# Altium schematic sheet 25-Power-CPU.SchDoc
size B; SheetNumber: 25; SheetTotal: 25; SPICEModelCachePRDMSQGY: <root> / <DocumentId>PRDMSQGY</DocumentId> / <CacheFrame Number="0"> / <Model Name="emk105bj105_v-f" Kind="CKT"> / <Text>* EMK105BJ105_V-F     SPICE MODEL  ( General Type ) / *-------------------------------------------------------------------------------------------------------- / * Model Generated by TAIYO YUDEN Corporation (http://www.ty-top.com) / * Version 1.0 / * TAIYO YUDEN Control No. 170508_130520 / * Copyright(c) 2012 TAIYO YUDEN CO.,LTD. All Rights Reserved. / *-------------------------------------------------------------------------------------------------------- / * / * Products Name : Multilayer Ceramic Capacitors / * / * Characteristics : / *     Capacitance : 1 uF , Rated Voltage : 16V , TCC : X5R / *     Case Size : 1.0 x 0.5 / 0.039 x 0.02 [mm/inch] , Thickness : 0.5 / 0.02 [mm/inch] / *     (Conditions: Temperature = 25 degC , DC Bias Current/Voltage = 0A / 0V) / * / * Frequency Range : 40Hz - 3GHz / * / * External Node Assignments : / * / *  1  o---| |---o  2 / * / *-------------------------------------------------------------------------------------------------------- / .SubCkt EMK105BJ105_V-F 1 2 / **************************** / C0 1 110 0.68309u / Cm 1 101 0.26053u / C1 101 102 0.94076u / Rc1 101 102 1.9029k / C2 102 103 0.66707u / Rc2 102 103 120.36 / C3 103 110 0.57203u / Rc3 103 110 2.1097 / C2m 1 301 0.1871u / C21 301 302 3.2494u / Rc21 301 302 1.1117k / C22 302 303 2.1014u / Rc22 302 303 1.484k / C23 303 304 2.1172u / Rc23 303 304 1.3876k / C24 304 305 0.75729u / Rc24 304 305 332.59 / C25 305 306 0.94401u / Rc25 305 306 249.09 / C26 306 307 0.34674u / Rc26 306 307 28.352 / C27 307 308 0.37158u / Rc27 307 308 19.989 / C28 308 309 0.17933u / Rc28 308 309 31.748 / C29 309 110 0.016445u / Rc29 309 110 1.0592 / Rp0 1 110 100Meg / L0 110 120 0.2216n / Lm 120 130 0.1509n / L1 120 121 0.12659n / RL1 121 130 0.85161 / L2 120 122 0.15996n / RL2 122 130 0.42469 / L3 120 123 7.9543n / RL3 123 130 0.54643m / CR 120 124 0.24334u / LR 124 125 0.090738n / RR 125 130 68.076m / CL 130 140 2.7354p / LL 130 140 0.10762n / RL 130 140 50.614 / Rs 140 2 7.5416m / **************************** / .ends EMK105BJ105_V-F</Text> / </Model> / </CacheFrame> / </root>
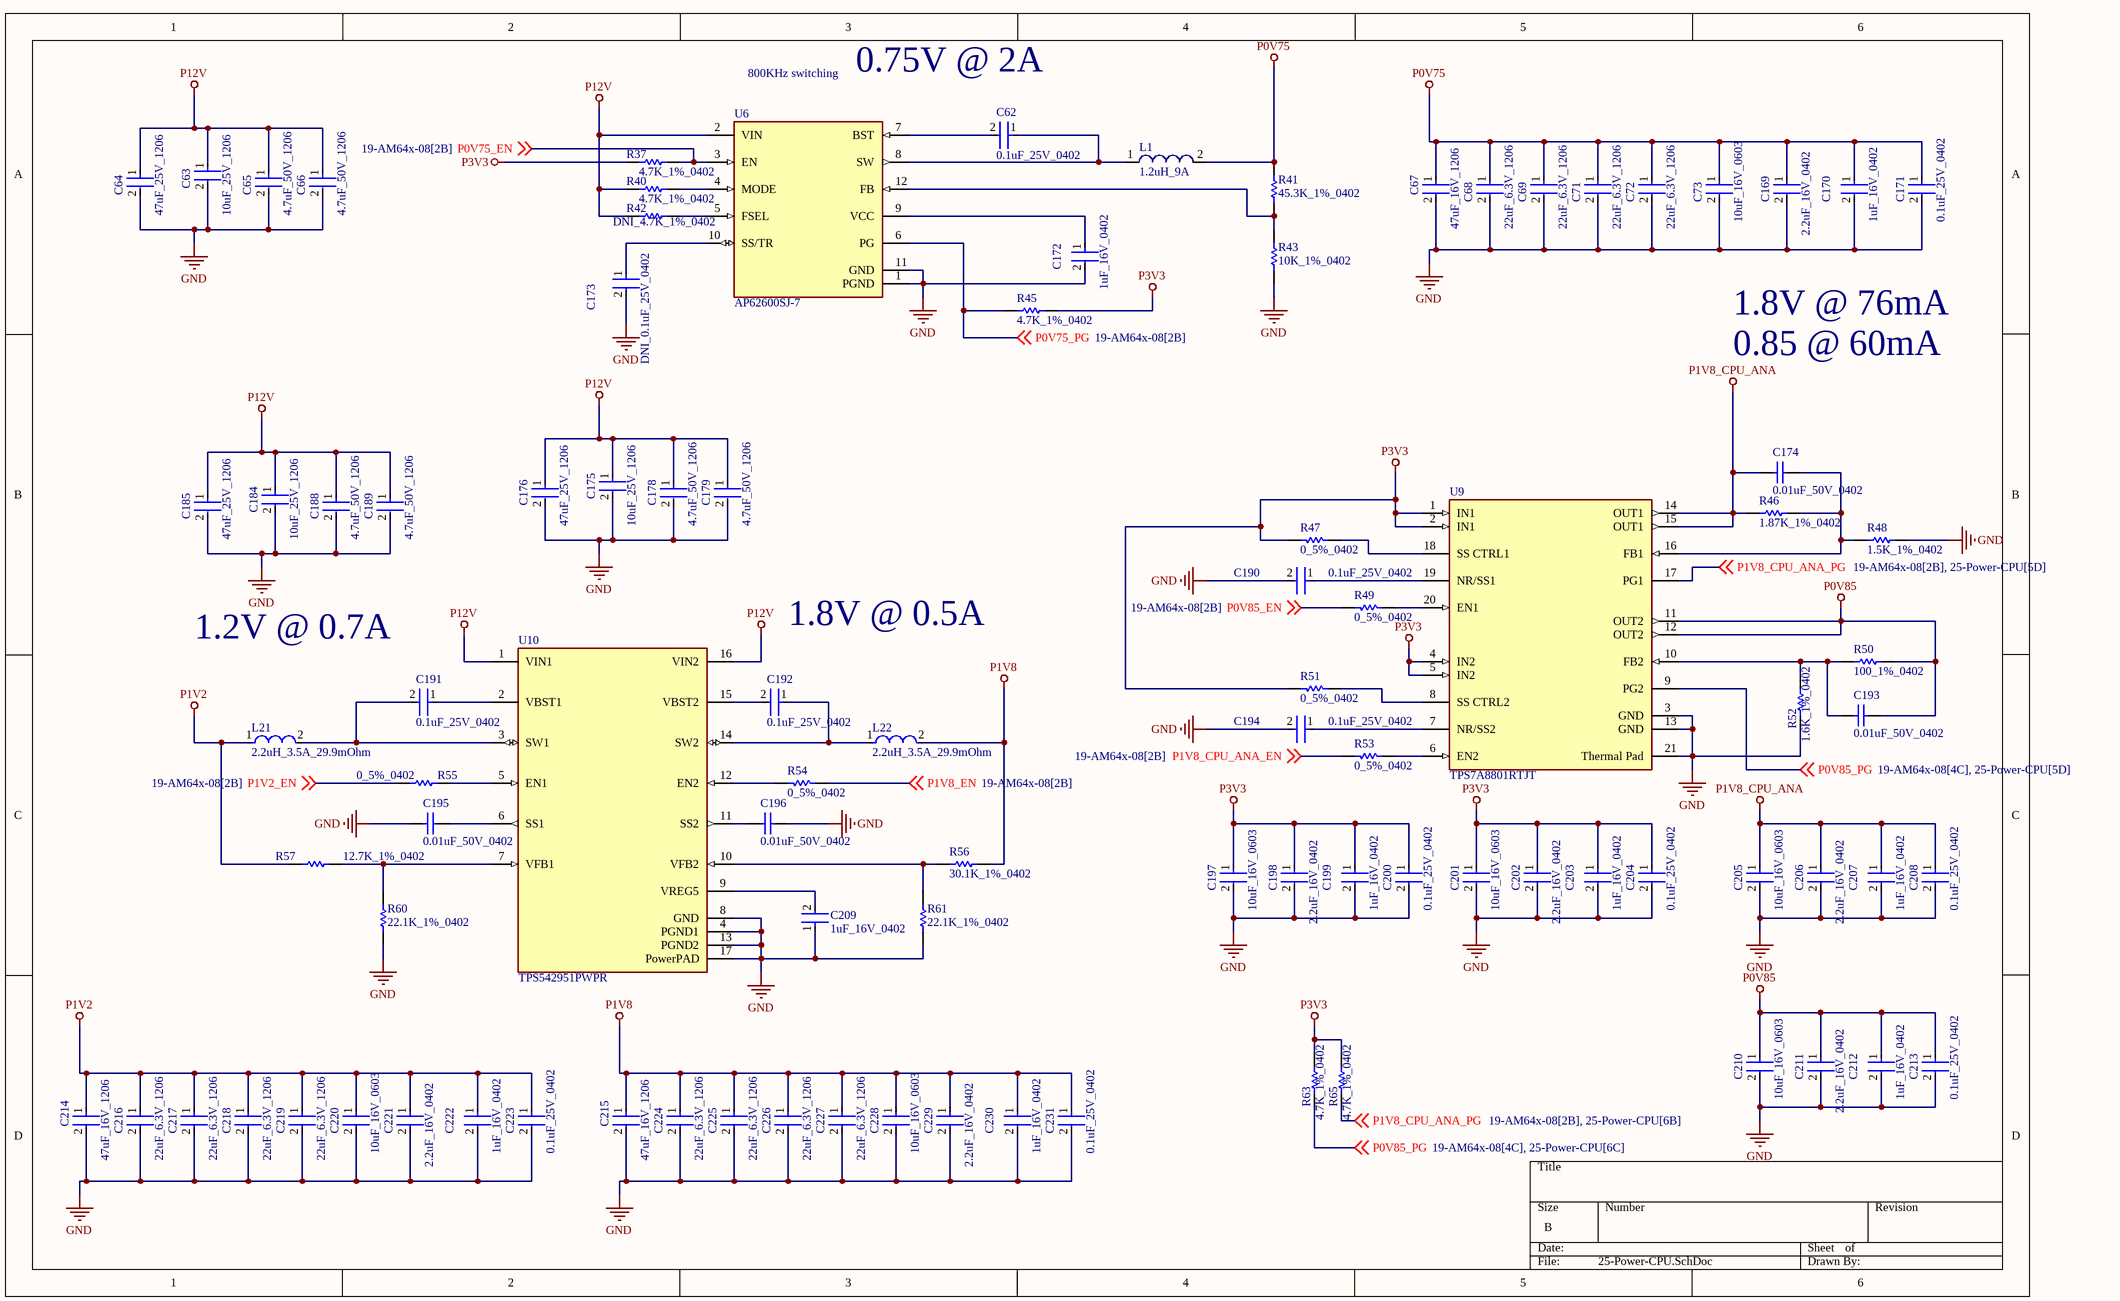
[diagram p0: 25-Power-CPU.SchDoc]

## Parts
C62  0.1uF_25V_0402  [FP-0402-L_1_0_1-W_0_5_0_1-IPC_C]
C63  10uF_25V_1206  [FP-1206-L_3_2_0_2-W_1_6_0-IPC_A]
C64  47uF_25V_1206  [FP-C3216-160-0_2-MFG]
C65  4.7uF_50V_1206  [FP-GRM31C-0_2-e0_3_0_8-IPC_C]
C66  4.7uF_50V_1206  [FP-GRM31C-0_2-e0_3_0_8-IPC_C]
C67  47uF_16V_1206  [FP-C3216-160-0_2-MFG]
C68  22uF_6.3V_1206  [FP-1206-L_3_2_0_2-W_1_6_0-IPC_C]
C69  22uF_6.3V_1206  [FP-1206-L_3_2_0_2-W_1_6_0-IPC_C]
C71  22uF_6.3V_1206  [FP-1206-L_3_2_0_2-W_1_6_0-IPC_C]
C72  22uF_6.3V_1206  [FP-1206-L_3_2_0_2-W_1_6_0-IPC_C]
C73  10uF_16V_0603  [FP-0603-L_1_6_0_2-W_0_8_0-MFG]
C169  2.2uF_16V_0402  [FP-C1005-050-0_05-IPC_A]
C170  1uF_16V_0402  [FP-0402-L_1_0_0_05-W_0_5-IPC_A]
C171  0.1uF_25V_0402  [FP-0402-L_1_0_1-W_0_5_0_1-IPC_C]
C172  1uF_16V_0402  [FP-0402-L_1_0_0_05-W_0_5-IPC_A]
C173  DNI_0.1uF_25V_0402  [FP-0402-L_1_0_1-W_0_5_0_1-IPC_C]  (no BOM)
C174  0.01uF_50V_0402  [CAPC1005X55X30LL05T10]
C175  10uF_25V_1206  [FP-1206-L_3_2_0_2-W_1_6_0-IPC_A]
C176  47uF_25V_1206  [FP-C3216-160-0_2-MFG]
C178  4.7uF_50V_1206  [FP-GRM31C-0_2-e0_3_0_8-IPC_C]
C179  4.7uF_50V_1206  [FP-GRM31C-0_2-e0_3_0_8-IPC_C]
C184  10uF_25V_1206  [FP-1206-L_3_2_0_2-W_1_6_0-IPC_A]
C185  47uF_25V_1206  [FP-C3216-160-0_2-MFG]
C188  4.7uF_50V_1206  [FP-GRM31C-0_2-e0_3_0_8-IPC_C]
C189  4.7uF_50V_1206  [FP-GRM31C-0_2-e0_3_0_8-IPC_C]
C190  0.1uF_25V_0402  [FP-0402-L_1_0_1-W_0_5_0_1-IPC_C]
C191  0.1uF_25V_0402  [FP-0402-L_1_0_1-W_0_5_0_1-IPC_C]
C192  0.1uF_25V_0402  [FP-0402-L_1_0_1-W_0_5_0_1-IPC_C]
C193  0.01uF_50V_0402  [CAPC1005X55X30LL05T10]
C194  0.1uF_25V_0402  [FP-0402-L_1_0_1-W_0_5_0_1-IPC_C]
C195  0.01uF_50V_0402  [CAPC1005X55X30LL05T10]
C196  0.01uF_50V_0402  [CAPC1005X55X30LL05T10]
C197  10uF_16V_0603  [FP-0603-L_1_6_0_2-W_0_8_0-MFG]
C198  2.2uF_16V_0402  [FP-C1005-050-0_05-IPC_A]
C199  1uF_16V_0402  [FP-0402-L_1_0_0_05-W_0_5-IPC_A]
C200  0.1uF_25V_0402  [FP-0402-L_1_0_1-W_0_5_0_1-IPC_C]
C201  10uF_16V_0603  [FP-0603-L_1_6_0_2-W_0_8_0-MFG]
C202  2.2uF_16V_0402  [FP-C1005-050-0_05-IPC_A]
C203  1uF_16V_0402  [FP-0402-L_1_0_0_05-W_0_5-IPC_A]
C204  0.1uF_25V_0402  [FP-0402-L_1_0_1-W_0_5_0_1-IPC_C]
C205  10uF_16V_0603  [FP-0603-L_1_6_0_2-W_0_8_0-MFG]
C206  2.2uF_16V_0402  [FP-C1005-050-0_05-IPC_A]
C207  1uF_16V_0402  [FP-0402-L_1_0_0_05-W_0_5-IPC_A]
C208  0.1uF_25V_0402  [FP-0402-L_1_0_1-W_0_5_0_1-IPC_C]
C209  1uF_16V_0402  [FP-0402-L_1_0_0_05-W_0_5-IPC_A]
C210  10uF_16V_0603  [FP-0603-L_1_6_0_2-W_0_8_0-MFG]
C211  2.2uF_16V_0402  [FP-C1005-050-0_05-IPC_A]
C212  1uF_16V_0402  [FP-0402-L_1_0_0_05-W_0_5-IPC_A]
C213  0.1uF_25V_0402  [FP-0402-L_1_0_1-W_0_5_0_1-IPC_C]
C214  47uF_16V_1206  [FP-C3216-160-0_2-MFG]
C215  47uF_16V_1206  [FP-C3216-160-0_2-MFG]
C216  22uF_6.3V_1206  [FP-1206-L_3_2_0_2-W_1_6_0-IPC_C]
C217  22uF_6.3V_1206  [FP-1206-L_3_2_0_2-W_1_6_0-IPC_C]
C218  22uF_6.3V_1206  [FP-1206-L_3_2_0_2-W_1_6_0-IPC_C]
C219  22uF_6.3V_1206  [FP-1206-L_3_2_0_2-W_1_6_0-IPC_C]
C220  10uF_16V_0603  [FP-0603-L_1_6_0_2-W_0_8_0-MFG]
C221  2.2uF_16V_0402  [FP-C1005-050-0_05-IPC_A]
C222  1uF_16V_0402  [FP-0402-L_1_0_0_05-W_0_5-IPC_A]
C223  0.1uF_25V_0402  [FP-0402-L_1_0_1-W_0_5_0_1-IPC_C]
C224  22uF_6.3V_1206  [FP-1206-L_3_2_0_2-W_1_6_0-IPC_C]
C225  22uF_6.3V_1206  [FP-1206-L_3_2_0_2-W_1_6_0-IPC_C]
C226  22uF_6.3V_1206  [FP-1206-L_3_2_0_2-W_1_6_0-IPC_C]
C227  22uF_6.3V_1206  [FP-1206-L_3_2_0_2-W_1_6_0-IPC_C]
C228  10uF_16V_0603  [FP-0603-L_1_6_0_2-W_0_8_0-MFG]
C229  2.2uF_16V_0402  [FP-C1005-050-0_05-IPC_A]
C230  1uF_16V_0402  [FP-0402-L_1_0_0_05-W_0_5-IPC_A]
C231  0.1uF_25V_0402  [FP-0402-L_1_0_1-W_0_5_0_1-IPC_C]
L1  1.2uH_9A  [WE-LHMI 7050]
L21  2.2uH_3.5A_29.9mOhm  [FP-NRS5030-H_3_1-MFG]
L22  2.2uH_3.5A_29.9mOhm  [FP-NRS5030-H_3_1-MFG]
R37  4.7K_1%_0402  [RESC1005X40X25NL10T10]
R40  4.7K_1%_0402  [RESC1005X40X25NL10T10]
R41  45.3K_1%_0402  [RESC1005X40X25ML05T10]
R42  DNI_4.7K_1%_0402  [RESC1005X40X25NL10T10]  (no BOM)
R43  10K_1%_0402  [RESC1005X40X25NL10T10]
R45  4.7K_1%_0402  [RESC1005X40X25NL10T10]
R46  1.87K_1%_0402  [RESC1005X40X25ML05T05]
R47  0_5%_0402  [RESC1005X40X25LL10T10]
R48  1.5K_1%_0402  [RESC1005X40X25NL05T10]
R49  0_5%_0402  [RESC1005X40X25LL10T10]
R50  100_1%_0402  [RESC1005X40X25ML05T10]
R51  0_5%_0402  [RESC1005X40X25LL10T10]
R52  1.6K_1%_0402  [RESC1005X40X25LL05T05]
R53  0_5%_0402  [RESC1005X40X25LL10T10]
R54  0_5%_0402  [RESC1005X40X25LL10T10]
R55  0_5%_0402  [RESC1005X40X25LL10T10]
R56  30.1K_1%_0402  [RESC1005X40X25NL10T10]
R57  12.7K_1%_0402  [RESC1005X40X25LL05T05]
R60  22.1K_1%_0402  [RESC1005X40X25NL10T10]
R61  22.1K_1%_0402  [RESC1005X40X25NL10T10]
R63  4.7K_1%_0402  [RESC1005X40X25NL10T10]
R65  4.7K_1%_0402  [RESC1005X40X25NL10T10]
U6  AP62600SJ-7  [FP-V-QFN2030-12_Type_A-MFG]
U9  TPS7A8801RTJT  [FP-RTJ0020D-MFG]
U10  TPS542951PWPR  [FP-PWP0016K-IPC_C]

## Nets
GND: C63.2 C64.2 C65.2 C66.2 C67.2 C68.2 C69.2 C71.2 C72.2 C73.2 C169.2 C170.2 C171.2 C172.2 C173.2 C175.2 C176.2 C178.2 C179.2 C184.2 C185.2 C188.2 C189.2 C190.2 C194.2 C195.1 C196.2 C197.2 C198.2 C199.2 C200.2 C201.2 C202.2 C203.2 C204.2 C205.2 C206.2 C207.2 C208.2 C209.1 C210.2 C211.2 C212.2 C213.2 C214.2 C215.2 C216.2 C217.2 C218.2 C219.2 C220.2 C221.2 C222.2 C223.2 C224.2 C225.2 C226.2 C227.2 C228.2 C229.2 C230.2 C231.2 R43.1 R48.1 R52.1 R60.1 R61.1 U6.1(PGND) U6.11(GND) U9.3(GND) U9.13(GND) U9.21(Thermal_Pad) U10.4(PGND1) U10.8(GND) U10.13(PGND2) U10.17(PowerPAD)
P0V75: C67.1 C68.1 C69.1 C71.1 C72.1 C73.1 C169.1 C170.1 C171.1 L1.2 R41.2
P0V85: C193.2 C210.1 C211.1 C212.1 C213.1 R50.2 U9.11(OUT2) U9.12(OUT2)
P1V2: C214.1 C216.1 C217.1 C218.1 C219.1 C220.1 C221.1 C222.1 C223.1 L21.1 R57.1
P1V8: C215.1 C224.1 C225.1 C226.1 C227.1 C228.1 C229.1 C230.1 C231.1 L22.2 R56.2
P1V8_CPU_ANA: C174.1 C205.1 C206.1 C207.1 C208.1 R46.1 U9.14(OUT1) U9.15(OUT1)
P3V3: C197.1 C198.1 C199.1 C200.1 C201.1 C202.1 C203.1 C204.1 R37.1 R45.1 R47.2 R51.2 R63.1 R65.1 U9.1(IN1) U9.2(IN1) U9.4(IN2) U9.5(IN2)
P12V: C63.1 C64.1 C65.1 C66.1 C175.1 C176.1 C178.1 C179.1 C184.1 C185.1 C188.1 C189.1 R40.1 R42.1 U6.2(VIN) U10.1(VIN1) U10.16(VIN2)
P0V75_EN: R37.2 U6.3(EN) ; off-sheet P0V75_EN
P0V75_PG: R45.2 U6.6(PG) ; off-sheet P0V75_PG
P0V85_EN: R49.2 ; off-sheet P0V85_EN
P0V85_PG: R63.2 U9.9(PG2) ; off-sheet P0V85_PG
P1V2_EN: R55.1 ; off-sheet P1V2_EN
P1V8_CPU_ANA_EN: R53.2 ; off-sheet P1V8_CPU_ANA_EN
P1V8_CPU_ANA_PG: R65.2 U9.17(PG1) ; off-sheet P1V8_CPU_ANA_PG
P1V8_EN: R54.1 ; off-sheet P1V8_EN
NetC62_1: C62.1 L1.1 U6.8(SW)
NetC62_2: C62.2 U6.7(BST)
NetC172_1: C172.1 U6.9(VCC)
NetC173_1: C173.1 U6.10(SS/TR)
NetC174_2: C174.2 R46.2 R48.2 U9.16(FB1)
NetC190_1: C190.1 U9.19(NR/SS1)
NetC191_1: C191.1 U10.2(VBST1)
NetC191_2: C191.2 L21.2 U10.3(SW1)
NetC192_1: C192.1 L22.1 U10.14(SW2)
NetC192_2: C192.2 U10.15(VBST2)
NetC193_1: C193.1 R50.1 R52.2 U9.10(FB2)
NetC194_1: C194.1 U9.7(NR/SS2)
NetC195_2: C195.2 U10.6(SS1)
NetC196_1: C196.1 U10.11(SS2)
NetC209_2: C209.2 U10.9(VREG5)
NetR40_2: R40.2 U6.4(MODE)
NetR41_1: R41.1 R43.2 U6.12(FB)
NetR42_2: R42.2 U6.5(FSEL)
NetR47_1: R47.1 U9.18(SS_CTRL1)
NetR49_1: R49.1 U9.20(EN1)
NetR51_1: R51.1 U9.8(SS_CTRL2)
NetR53_1: R53.1 U9.6(EN2)
NetR54_2: R54.2 U10.12(EN2)
NetR55_2: R55.2 U10.5(EN1)
NetR56_1: R56.1 R61.2 U10.10(VFB2)
NetR57_2: R57.2 R60.2 U10.7(VFB1)

## Notes on the sheet
- 800KHz switching
- 0.75V @ 2A
- 0.85 @ 60mA
- 1.8V @ 76mA
- 1.2V @ 0.7A
- 1.8V @ 0.5A

## Library data of the parts
C62 C171 C173 C190-C192 C194 C200 C204 C208 C213 C223 C231 = CMP-2008-02519-2: General Purpose Ceramic Capacitor, 0402, 100nF, 10%, X7R, 15%, 25V; Package Quantity: 1; Capacitance: 100nF; Min Operating Temperature: -55°C; Voltage: 25V; Voltage Rating: 25V; Construction: Flat; Max Operating Temperature: 125°C; Radiation Hardening: No; Depth: 0.5mm; Thickness: 0.022inch; Voltage Rating (DC): 25V; Number of Pins: 2; Lead Free: Lead Free; Series: -; REACH SVHC: No SVHC; Length: 1mm; Dielectric: X7R; RoHS Compliant: Yes; Mount: Surface Mount; Packaging: Tape and Reel; Case/Package: 0402; Case Code (Imperial): 0402; Termination: SMD/SMT; Width: 0.02inch; Case Code (Metric): 1005; Tolerance: 10%
C63 C175 C184 = CMP-04427-006943-1: General Purpose Ceramic Capacitor, 1206, 10uF, 20%, X5R, 15%, 25V; Dissipation Factor: 12.5%; Insulation Resistance: 10GR; Case Code (Imperial): 1206; Series: -; Construction: Flat; Termination: SMD/SMT; Case/Package: 1206; Dielectric: X5R; Width: 1.6mm; Max Operating Temperature: 85°C; Height: 0.07mm; Package Quantity: 1; Depth: 1.6mm; Voltage Rating: 25V; Capacitance: 10uF; RoHS Compliant: Yes; Mount: Surface Mount; Radiation Hardening: No; Voltage Rating (DC): 25V; Number of Pins: 2; Contact Plating: Tin; Min Operating Temperature: -55°C; Lead Free: Lead Free; Packaging: Tape and Reel; Tolerance: 20%; Case Code (Metric): 3216; Thickness: 0.07inch; Length: 3.2mm; REACH SVHC: No SVHC
C64 C176 C185 = CMP-2000-05397-3: Multilayer Ceramic Capacitors 47uF ±20% 25V X5R SMD 1206; Weight: 0.000571oz; Dielectric: X5R; Length: 0.126inch; Voltage Rating: 25V; Case/Package: 1206; Dielectric Material: Ceramic; Min Operating Temperature: -55°C; Lead Free: Lead Free; Packaging: Tape and Reel; Package Quantity: 1; Mount: Surface Mount; Depth: 1.6mm; REACH SVHC: No SVHC; Termination: SMD/SMT; Case Code (Imperial): 1206; Series: C; Resistor Type: Ceramic; Voltage: 25V; Width: 0.063inch; Height: 1.6mm; Tolerance: 20%; Capacitance: 47uF; Max Operating Temperature: 85°C; Voltage Rating (DC): 25V; RoHS Compliant: Yes; Thickness: 0.071inch; Case Code (Metric): 3216
C65 C66 C178 C179 C188 C189 = CMP-1037-04923-3: Chip Multilayer Ceramic Capacitors for General Purpose, 1206, 4.7uF, X7R, 15%, 10%, 50V; Height: 1.6mm; Voltage: 50V; Capacitance: 4.7uF; Lead Free: Lead Free; Max Operating Temperature: 125°C; Packaging: Tape and Reel; REACH SVHC: No SVHC; Voltage Rating: 50V; Mount: Surface Mount; Termination: SMD/SMT; Tolerance: 10%; Case/Package: 1206; Material: Ceramic; Depth: 1.6mm; Length: 3.2mm; Case Code (Metric): 3216; Voltage Rating (DC): 50V; Case Code (Imperial): 1206; Radiation Hardening: No; Width: 0.063inch; Thickness: 0.071inch; Package Quantity: 2000; Min Operating Temperature: -55°C; Dielectric: X7R
C67 C214 C215 = CMP-2000-07442-2: Multilayer Ceramic Capacitors 47uF ±20% 16V X5R SMD 1206; Resistor Type: Ceramic; Width: 0.063inch; Case Code (Imperial): 1206; Radiation Hardening: No; Thickness: 0.071inch; Dielectric: X5R; Weight: 0.000571oz; Termination: SMD/SMT; Dielectric Material: Ceramic; Min Operating Temperature: -55°C; Depth: 1.6mm; Case Code (Metric): 3216; Max Operating Temperature: 85°C; RoHS Compliant: Yes; REACH SVHC: No SVHC; Mount: Surface Mount; Lead Free: Lead Free; Height: 1.6mm; Length: 3.2mm; Tolerance: 20%; Voltage Rating (DC): 16V; Capacitance: 47uF; Package Quantity: 1; Construction: Flat; Packaging: Tape and Reel; Series: C; Case/Package: 1206; Voltage Rating: 16V
C68 C69 C71 C72 C216-C219 C224-C227 = CMP-2000-05869-2: General Purpose Ceramic Capacitor, 1206, 22uF, 20%, X5R, 15%, 6.3V; Lead Free: Lead Free; Case Code (Metric): 3216; Case/Package: 1206; Depth: 1.6mm; Capacitance: 22uF; Length: 3.2mm; Series: -; Contact Plating: Tin; Tolerance: 20%; REACH SVHC: No SVHC; Radiation Hardening: No; RoHS Compliant: Yes; Termination: SMD/SMT; Voltage Rating: 6.3V; Packaging: Tape and Reel; Voltage: 6.3V; Mount: Surface Mount; Thickness: 0.07inch; Package Quantity: 1; Voltage Rating (DC): 6.3V; Case Code (Imperial): 1206; Construction: Flat; Dielectric: X5R; Number of Pins: 2; Min Operating Temperature: -55°C; Height: 0.07mm; Width: 0.063inch; Max Operating Temperature: 85°C
C73 C197 C201 C205 C210 C220 C228 = CMP-2000-06226-4: Multilayer Ceramic Capacitor 10uF 16V X5R 20% SMD 0603 T/R; Packaging: Tape and Reel; Construction: Flat; Height: 0.8mm; Max Operating Temperature: 85°C; Dielectric: X5R; Case Code (Metric): 1608; Voltage Rating (DC): 16V; Width: 0.031inch; Voltage Rating: 16V; Length: 0.063inch; RoHS Compliant: Yes; Halogen Free: Halogen Free; Case Code (Imperial): 0603; Capacitance: 10uF; Mount: Surface Mount; Thickness: 0.031inch; Tolerance: 20%; Min Operating Temperature: -55°C; Series: M; Termination: SMD/SMT; Case/Package: 0603; Package Quantity: 1
C169 C198 C202 C206 C211 C221 C229 = CMP-2000-05998-2: Multilayer Ceramic Capacitors 2.2μF ±10% 16V X5R SMD 0402; Capacitance: 2.2uF; REACH SVHC: No SVHC; Series: C; Termination: SMD/SMT; Case Code (Imperial): 0402; Depth: 0.5mm; Mount: Surface Mount; Width: 0.02inch; Package Quantity: 1; Dielectric Material: Ceramic; Length: 1mm; Packaging: Tape and Reel; Case Code (Metric): 1005; RoHS Compliant: Yes; Dielectric: X5R; Max Operating Temperature: 85°C; Lead Free: Lead Free; Weight: 2.3E-05oz; Thickness: 0.022inch; Voltage Rating (DC): 16V; Tolerance: 10%; Voltage Rating: 16V; Resistor Type: Ceramic; Height: 0.5mm; Case/Package: 0402; Min Operating Temperature: -55°C
C170 C172 C199 C203 C207 C209 C212 C222 C230 = CMP-14477-000104-2: None; Tolerance: 10%; Voltage Rating: 16V; Dielectric: X5R; Capacitance: 1uF; Packaging: Tape and Reel; Depth: 0.5mm; Mount: Surface Mount; Thickness: 0.022inch; Package Quantity: 1; Min Operating Temperature: -55°C; Series: M; Voltage Rating (DC): 16V; Termination: SMD/SMT; Case/Package: 0402; Number of Pins: 2; Case Code (Imperial): 0402; Length: 1mm; Halogen Free: Halogen Free; Case Code (Metric): 1005; Width: 0.02inch; RoHS Compliant: Yes; Radiation Hardening: No; Max Operating Temperature: 85°C; Height: 0.5mm; Construction: Flat
C174 C193 C195 C196 = CMP-1034-01886-2: Part Number: C0402C103K5RACTU; Manufacturer: Kemet
L1 = CMP-1353-00066-2: SMD Power Inductor WE-LHMI, L=1.2 µH; Manufacturer: Wuerth Elektronik; PartNumber: 74437349012; Inductance: 1.2 ÂµH; ComponentLink1Description: Manufacturer URL; ComponentLink2URL: http://katalog.we-online.de/kataloge/eisos/media/pdf/74437349012.pdf; ComponentLink1URL: http://www.we-online.com; PackageReference: WE-LHMI 7050; ComponentLink2Description: Datasheet
L21 L22 = CMP-14484-000464-1: Inductor Power Shielded Wirewound 2.2uH 30% 100KHz Ferrite 3.5A 29.9mΩ DCR Automotive T/R; Self Resonant Frequency: 46MHz; Saturation Current: 4.2A; DC Resistance (DCR): 29.9mR; Radiation Hardening: No; Inductance: 2.2uH; Resistor Type: Wirewound; Package Quantity: 500; Width: 0.193inch; Termination: SMD/SMT; Core Material: Ferrite; Mount: Surface Mount; Shielding: Shielded; Max DC Current: 3.5A; Tolerance: 30%; Depth: 4.9mm; Max Operating Temperature: 125°C; Current Rating: 3.5A; Case/Package: Nonstandard; Ratings: AEC-Q200; Packaging: Tape and Reel; Length: 0.193inch; Min Operating Temperature: -40°C; Height - Seated (Max): 0.118inch; Test Frequency: 100kHz; Height: 3mm; Halogen Free: Halogen Free
R37 R40 R42 R45 R63 R65 = CMP-2002-05217-1: Manufacturer: Bourns; Part Number: CR0402-FX-4701GLF
R41 = CMP-2002-07692-1: Part Number: RC0402FR-0745K3L; Manufacturer: Yageo / Phycomp
R43 = CMP-2002-04694-1: Manufacturer: Bourns; Part Number: CR0402-FX-1002GLF
R46 = CMP-2002-00742-1: Manufacturer: Panasonic; Part Number: ERJ-2RKF1871X
R47 R49 R51 R53-R55 = CMP-2002-04569-1: Manufacturer: KOA Speer; Part Number: RK73Z1ETTP
R48 = CMP-2002-06462-1: Part Number: ERJ-U02F1501X; Manufacturer: Panasonic
R50 = CMP-2002-06458-1: Part Number: ERJ-U02F1000X; Manufacturer: Panasonic
R52 = CMP-2002-00708-1: Manufacturer: Panasonic; Part Number: ERJ-2RKF1601X
R56 = CMP-2002-03884-1: Manufacturer: KOA Speer; Part Number: RK73H1ETTP3012F
R57 = CMP-2002-00657-1: Manufacturer: Panasonic; Part Number: ERJ-2RKF1272X
R60 R61 = CMP-2002-04298-1: Manufacturer: KOA Speer; Part Number: RK73H1ETTP2212F
U6 = CMP-12757-000022-1: DCDC CONV HV BUCK,V-QFN2030-12; RoHS Compliant: Yes
U9 = CMP-04917-000013-1: IC REG LINEAR POS ADJ 1A 20QFN; Manufacturer: Texas Instruments; Output Voltage: 0.8-5V; Standoff Height: 0mm; Nominal Supply Current: 2mA; Accuracy Percentage: 1%; Max Junction Temp: +125°C; Output Type: AdjustableProgrammable; Min Supply Voltage: 1.4V; Dropout Voltage: 200mV; Max Supply Voltage: 6.5V; Number Of Outputs: 2; Digikey Description: IC REG LINEAR POS ADJ 1A 20QFN; RoHS: TRUE; Temperature: -40°C to +125°C; Height: 0.8mm; Package: RTJ0020D; Category: IC; Ipc Land Pattern Name: QFN50P400X400X75-20; Temperature Range High: +125°C; ComponentLink2URL: http://www.ti.com/lit/ds/symlink/tps7a88.pdf; Device Class L2: Power Management ICs; Octopart: https://octopart.com/tps7a8801rtjt-texas+instruments-68059618; Device Class L3: Voltage Regulators - Linear; Manufacturer Part Number: TPS7A8801RTJT; Automotive: No; ComponentLink2Description: Datasheet; Device Class L1: Integrated Circuits (ICs); Temperature Range Low: -40°C; Lead Free: Yes; Output Current: 1A; Mouser Description: LDO Voltage Regulators Dual 1A LDO
U10 = CMP-04918-000518-1: IC REG BCK ADJ 2A/3A DL 16HTSSOP; Quiescent Current: 1.3mA; Max Input Voltage: 18V; Synchronous Rectifier: Yes; Output Voltage: 7V; Output Current: 3A; Min Input Voltage: 4.5V; Switching Frequency: 700kHz; Number of Outputs: 2; Output Type: Adjustable; Package Quantity: 2000; Contact Plating: Gold; Case/Package: HTSSOP; Max Operating Temperature: 85°C; Operating Supply Voltage: 18V; Packaging: Tape and Reel; Lead Free: Lead Free; Min Operating Temperature: -40°C; RoHS Compliant: Yes; Number of Pins: 16; Mount: Surface Mount; Series: D-CAP2™, Eco-Mode™